# EAGLE design avr_pcb (EAGLE 9.1.0)
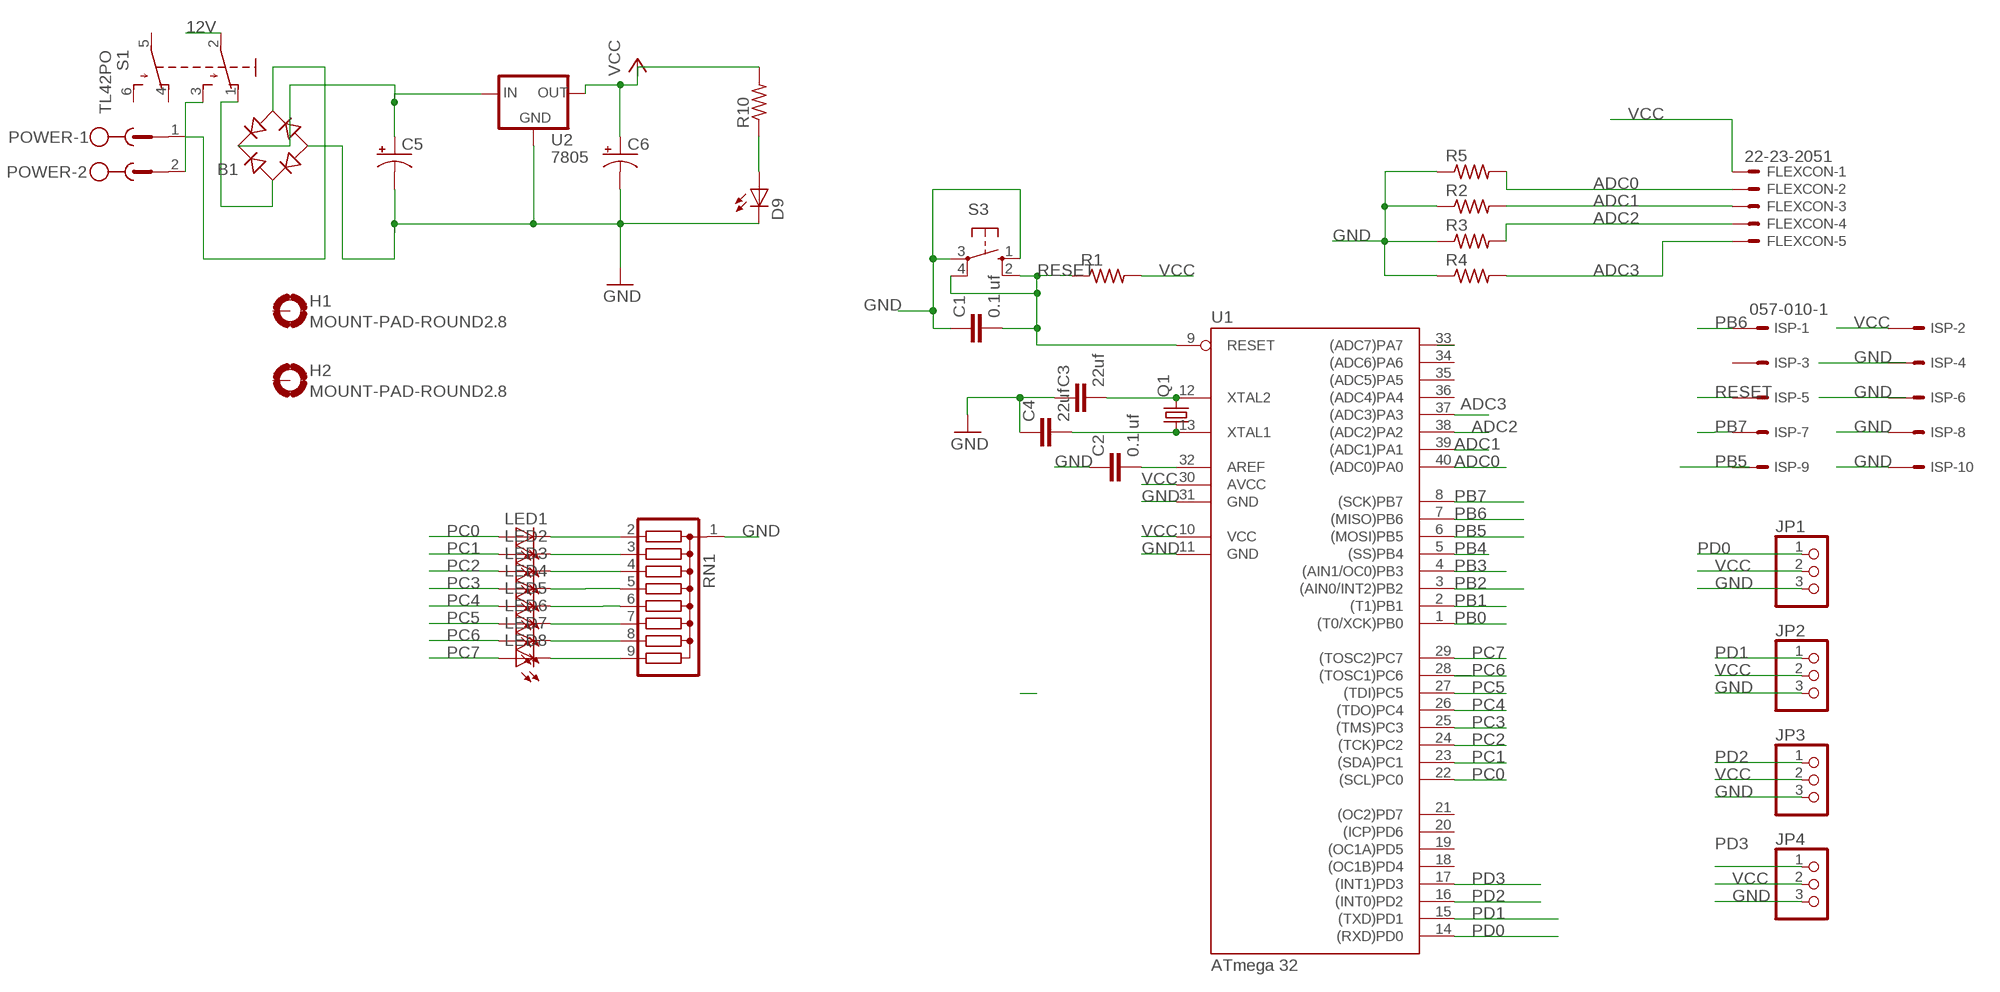
[diagram p0: schematic, sheet 1]

## Parts
B1  RB1A  [RB1A]
C1  0.1 uf  C-EU025-024X044  [C025-024X044]
C2  0.1 uf  C-EU025-024X044  [C025-024X044]
C3  22uf  C-EU025-024X044  [C025-024X044]
C4  22uf  C-EU025-024X044  [C025-024X044]
C5  CPOL-USE5-6  [E5-6]
C6  CPOL-USE5-6  [E5-6]
D9  LED3MM  [LED3MM]
FLEXCON  22-23-2051  [22-23-2051]
H1  MOUNT-PAD-ROUND2.8  [2,8-PAD]
H2  MOUNT-PAD-ROUND2.8  [2,8-PAD]
ISP  057-010-1  [057-010-1]
JP1  PINHD-1X3  [1X03]
JP2  PINHD-1X3  [1X03]
JP3  PINHD-1X3  [1X03]
JP4  PINHD-1X3  [1X03]
LED1  LED3MM  [LED3MM]
LED2  LED3MM  [LED3MM]
LED3  LED3MM  [LED3MM]
LED4  LED3MM  [LED3MM]
LED5  LED3MM  [LED3MM]
LED6  LED3MM  [LED3MM]
LED7  LED3MM  [LED3MM]
LED8  LED3MM  [LED3MM]
POWER  MSTBV2  [MSTBV2]
Q1  CRYSTALHC18U-V  [HC18U-V]
R1  R-US_0204/7  [0204/7]
R2  R-US_0204/7  [0204/7]
R3  R-US_0204/7  [0204/7]
R4  R-US_0204/7  [0204/7]
R5  R-US_0204/7  [0204/7]
R10  R-US_0204/7  [0204/7]
RN1  G08R  [SIL9]
S1  TL42PO  [TL4XPO]
S3  10-XX  [B3F-10XX]
U1  ATmega 32  MEGA32-P  [DIL40]
U2  7805  78XXL  [78XXL]

## Nets
12V: S1.2(P)
ADC0: FLEXCON.2 R5.2 U1.40((ADC0)PA0)
ADC1: FLEXCON.3 R2.2 U1.39((ADC1)PA1)
ADC2: FLEXCON.4 R3.2 U1.38((ADC2)PA2)
ADC3: FLEXCON.5 R4.2 U1.37((ADC3)PA3)
GND: B1.- C1.1 C2.1 C3.1 C4.1 C5.- C6.- D9.K(C) ISP.4 ISP.6 ISP.8 ISP.10 JP1.3 JP2.3 JP3.3 JP4.3 R2.1 R3.1 R4.1 R5.1 RN1.1 S3.1(S) S3.3(P) U1.11(GND) U1.31(GND) U2.GND
N$1: B1.AC1 S1.1(O)
N$2: D9.A R10.1
N$3: C3.2 Q1.2 U1.12(XTAL2)
N$4: C4.2 Q1.1 U1.13(XTAL1)
N$6: C2.2 U1.32(AREF)
N$8: B1.AC2 POWER.1
N$9: LED1.K(C) RN1.2
N$10: LED2.K(C) RN1.3
N$11: LED3.K(C) RN1.4
N$12: LED4.K(C) RN1.5
N$13: LED5.K(C) RN1.6
N$14: LED6.K(C) RN1.7
N$15: LED7.K(C) RN1.8
N$16: LED8.K(C) RN1.9
N$17: POWER.2 S1.3(S)
N$23: B1.+ C5.+ U2.IN
PA7: U1.33((ADC7)PA7)
PB0: U1.1((T0/XCK)PB0)
PB1: U1.2((T1)PB1)
PB2: U1.3((AIN0/INT2)PB2)
PB3: U1.4((AIN1/OC0)PB3)
PB4: U1.5((SS)PB4)
PB5: ISP.9 U1.6((MOSI)PB5)
PB6: ISP.1 U1.7((MISO)PB6)
PB7: ISP.7 U1.8((SCK)PB7)
PC0: LED1.A U1.22((SCL)PC0)
PC1: LED2.A U1.23((SDA)PC1)
PC2: LED3.A U1.24((TCK)PC2)
PC3: LED4.A U1.25((TMS)PC3)
PC4: LED5.A U1.26((TDO)PC4)
PC5: LED6.A U1.27((TDI)PC5)
PC6: LED7.A U1.28((TOSC1)PC6)
PC7: LED8.A U1.29((TOSC2)PC7)
PD0: JP1.1 U1.14((RXD)PD0)
PD1: JP2.1 U1.15((TXD)PD1)
PD2: JP3.1 U1.16((INT0)PD2)
PD3: JP4.1 U1.17((INT1)PD3)
RESET: C1.2 ISP.5 R1.1 S3.2(S1) S3.4(P1) U1.9(RESET)
VCC: C6.+ FLEXCON.1 ISP.2 JP1.2 JP2.2 JP3.2 JP4.2 R1.2 R10.2 U1.10(VCC) U1.30(AVCC) U2.OUT
Unconnected: H1.B2,8(MOUNT) H2.B2,8(MOUNT) ISP.3 S1.4(O1) S1.5(P1) S1.6(S1) U1.18((OC1B)PD4) U1.19((OC1A)PD5) U1.20((ICP)PD6) U1.21((OC2)PD7) U1.34((ADC6)PA6) U1.35((ADC5)PA5) U1.36((ADC4)PA4)

## Library data of the parts
B1 = rectifier:RB1A: RECTIFIER 1 A
C1-C4 = rcl:C-EU: CAPACITOR, European symbol
C5 C6 = rcl:CPOL-US: POLARIZED CAPACITOR, American symbol; SPICEPREFIX: C
D9 LED1-LED8 = led:LED: LED OSRAM: - CHIPLED LG R971, LG N971, LY N971, LG Q971, LY Q971, LO R971, LY R971 LH N974, LH R974 LS Q976, LO Q976, LY Q976 LO Q996 - Hyper CHIPLED LW Q18S LB Q993, LB Q99A, LB R99A - SideLED LS A670, LO A670, LY A670, LG A670, LP A670 LB A673, LV A673, LT A673, LW A673 LH A674 LY A675 LS A676, LA A676, LO A676, LY A676, LW A676 LS A679, LY A679, LG A679 - Hyper Micro SIDELED® LS Y876, LA Y876, LO Y876, LY Y876 LT Y87S - SmartLED LW L88C, LW L88S LB L89C, LB L89S, LG L890 LS L89K, LO L89K, LY L89K LS L896, LA L896, LO L896, LY L896 - TOPLED LS T670, LO T670, LY T670, LG T670, LP T670 LSG T670, LSP T670, LSY T670, LOP T670, LYG T670 LG T671, LOG T671, LSG T671 LB T673, LV T673, LT T673, LW T673 LH T674 LS T676, LA T676, LO T676, LY T676, LB T676, LH T676, LSB T676, LW T676 LB T67C, LV T67C, LT T67C, LS T67K, LO T67K, LY T67K, LW E67C LS E67B, LA E67B, LO E67B, LY E67B, LB E67C, LV E67C, LT E67C LW T67C LS T679, LY T679, LG T679 LS T770, LO T770, LY T770, LG T770, LP T770 LB T773, LV T773, LT T773, LW T773 LH T774 LS E675, LA E675, LY E675, LS T675 LS T776, LA T776, LO T776, LY T776, LB T776 LHGB T686 LT T68C, LB T68C - Hyper Mini TOPLED® LB M676 - Mini TOPLED Santana® LG M470 LS M47K, LO M47K, LY M47K Source: http://www.osram.convergy.de LUXEON: - LUMILED® LXK2-PW12-R00, LXK2-PW12-S00, LXK2-PW14-U00, LXK2-PW14-V00 LXK2-PM12-R00, LXK2-PM12-S00, LXK2-PM14-U00 LXK2-PE12-Q00, LXK2-PE12-R00, LXK2-PE12-S00, LXK2-PE14-T00, LXK2-PE14-U00 LXK2-PB12-K00, LXK2-PB12-L00, LXK2-PB12-M00, LXK2-PB14-N00, LXK2-PB14-P00, LXK2-PB14-Q00 LXK2-PR12-L00, LXK2-PR12-M00, LXK2-PR14-Q00, LXK2-PR14-R00 LXK2-PD12-Q00, LXK2-PD12-R00, LXK2-PD12-S00 LXK2-PH12-R00, LXK2-PH12-S00 LXK2-PL12-P00, LXK2-PL12-Q00, LXK2-PL12-R00 Source: www.luxeon.com KINGBRIGHT: KA-3528ASYC Source: www.kingbright.com
FLEXCON = con-molex:22-23-2051: .100" (2.54mm) Center Header - 5 Pin; MF: MOLEX; MPN: 22-23-2051; OC_FARNELL: 1462952; OC_NEWARK: 38C9178
H1 H2 = holes:MOUNT-PAD-ROUND: MOUNTING PAD, round
ISP = con-panduit:057-010-: CONNECTOR 10-pin series 057 contact pc board low profile headers; OC_FARNELL: unknown; OC_NEWARK: unknown
JP1 = pinhead:PINHD-1X3: PIN HEADER; SPICEPREFIX: J
JP2-JP4 = pinhead:PINHD-1X3: PIN HEADER
POWER = con-phoenix-500:MSTBV2: PHOENIX; OC_FARNELL: unknown; OC_NEWARK: unknown
Q1 = crystal:CRYSTAL: CRYSTAL; OC_FARNELL: unknown; OC_NEWARK: unknown
R1-R5 R10 = resistor:R-US_: RESISTOR, American symbol
RN1 = resistor-sil:G08R: SIL RESISTOR; OC_FARNELL: unknown; OC_NEWARK: unknown
S1 = switch:TL42PO: TINY SWITCH ON - MOM Source: http://www2.produktinfo.conrad.com/datenblaetter/700000-724999/705152-da-01-de-Subminiaturschalter_TL_36YO.pdf
S3 = switch-omron:10-XX: OMRON SWITCH; MPN: B3F-1000; OC_FARNELL: 176432; OC_NEWARK: 36M3542
U1 = atmel:MEGA32-P: MICROCONTROLLER 32 Kbytes FLASH 2 Kbytes SRAM 1 Kbytes EEPROM USART 8-channel 10 bit ADC Source: www.atmel.com .. doc2503.pdf; MPN: ATMEGA32-16PU; OC_FARNELL: 1661729; OC_NEWARK: 51P1794
U2 = v-reg:78XXL: VOLTAGE REGULATOR

## Board
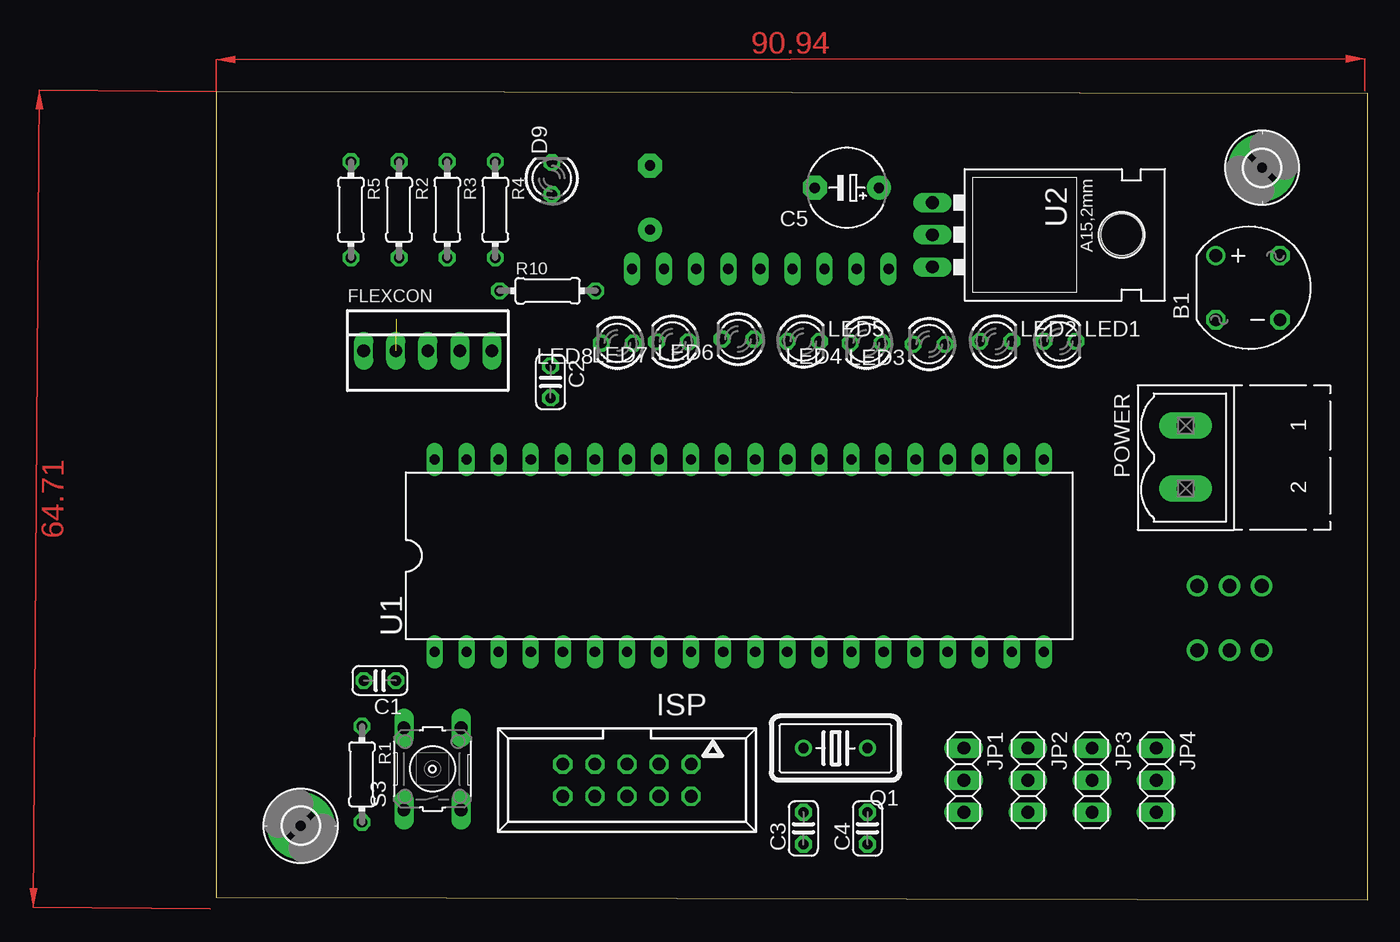
[diagram p1: board, top side]
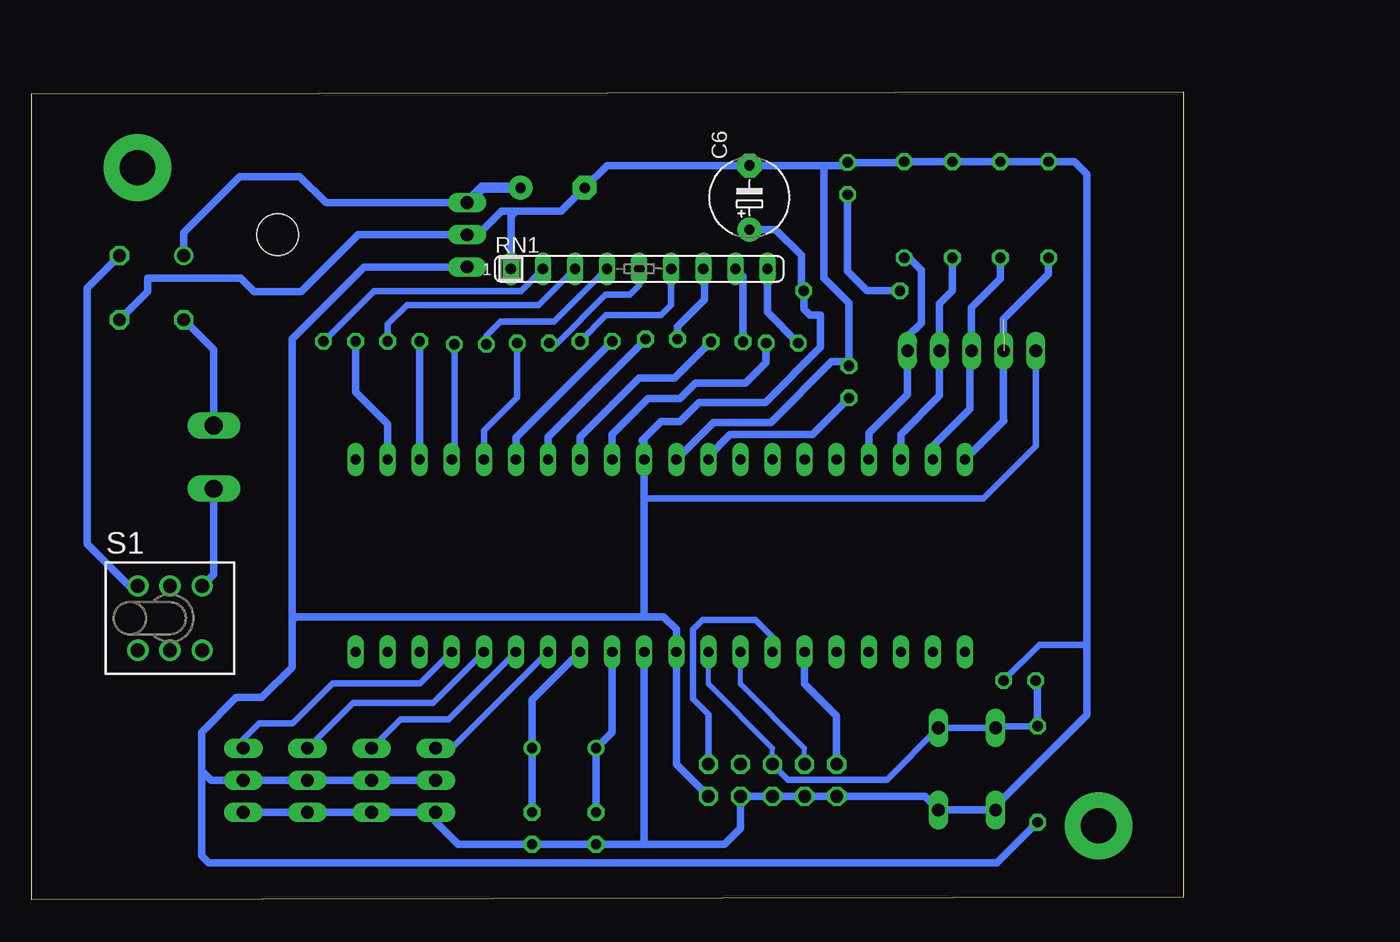
[diagram p2: board, bottom side, seen from below]

Size 91.2 x 64.01 mm. Coordinates in mm from the lower left corner, seen from the top.
Outline: 0.01,0.17 91.2,0 91.19,63.84 0,64.01 0.01,0.17
Copper layers (1*16): Top 0.035mm / dielectric 1.5mm / Bottom 0.035mm
Design rules "default": minimum track width 6mil, minimum drill 0.35mm, track to track 6mil, track to pad 6mil, pad to pad 6mil, via to via 6mil, smd to smd 6mil, copper to edge 40mil, drill to drill 6mil, minimum pad ring 10mil, minimum via ring 8mil, stop-mask expansion 4mil, vias tented up to drill 0mil, thermal gap 10mil

### Footprints (pad centres in the part's own frame; a part is rotated, then mirrored left to right if it is on the bottom)
RB1A = drill 1.016: + -2.54,2.54 | drill 1.016 octagon: - 2.54,-2.54; AC1 2.54,2.54; AC2 -2.54,-2.54
C025-024X044 = drill 0.813 octagon: 1 -1.27,0; 2 1.27,0
E5-6 = drill 0.813 pad 1.905: + -2.54,0 | drill 0.813 pad 1.905 octagon: - 2.54,0
LED3MM = drill 0.813 octagon: A -1.27,0; K 1.27,0
22-23-2051 = drill 1 long: 1 -5.08,0; 2 -2.54,0; 3 0,0; 4 2.54,0; 5 5.08,0
2,8-PAD = drill 2.8 pad 5.334: B2,8 0,0
057-010-1 = drill 1 octagon: 1 -5.08,-1.27; 2 -5.08,1.27; 3 -2.54,-1.27; 4 -2.54,1.27; 5 0,-1.27; 6 0,1.27; 7 2.54,-1.27; 8 2.54,1.27; 9 5.08,-1.27; 10 5.08,1.27
1X03 = drill 1.016 long: 1 -2.54,0; 2 0,0; 3 2.54,0
MSTBV2 = drill 1.397 long: 1 -2.5,0; 2 2.5,0
HC18U-V = drill 0.813: 1 -2.54,0; 2 2.54,0
0204/7 = drill 0.813 octagon: 1 -3.81,0; 2 3.81,0
SIL9 = drill 0.813 long: 1 -10.16,0; 2 -7.62,0; 3 -5.08,0; 4 -2.54,0; 5 0,0; 6 2.54,0; 7 5.08,0; 8 7.62,0; 9 10.16,0
TL4XPO = drill 1.1 pad 1.676: 1 -2.54,2.54; 2 0,2.54; 3 2.54,2.54; 4 -2.54,-2.54; 5 0,-2.54; 6 2.54,-2.54
B3F-10XX = drill 1.016 long: 1 -3.251,2.261; 2 3.251,2.261; 3 -3.251,-2.261; 4 3.251,-2.261
DIL40 = drill 0.813 long: 1 -24.13,-7.62; 2 -21.59,-7.62; 3 -19.05,-7.62; 4 -16.51,-7.62; 5 -13.97,-7.62; 6 -11.43,-7.62; 7 -8.89,-7.62; 8 -6.35,-7.62; 9 -3.81,-7.62; 10 -1.27,-7.62; 11 1.27,-7.62; 12 3.81,-7.62; 13 6.35,-7.62; 14 8.89,-7.62; 15 11.43,-7.62; 16 13.97,-7.62; 17 16.51,-7.62; 18 19.05,-7.62; 19 21.59,-7.62; 20 24.13,-7.62; 21 24.13,7.62; 22 21.59,7.62; 23 19.05,7.62; 24 16.51,7.62; 25 13.97,7.62; 26 11.43,7.62; 27 8.89,7.62; 28 6.35,7.62; 29 3.81,7.62; 30 1.27,7.62; 31 -1.27,7.62; 32 -3.81,7.62; 33 -6.35,7.62; 34 -8.89,7.62; 35 -11.43,7.62; 36 -13.97,7.62; 37 -16.51,7.62; 38 -19.05,7.62; 39 -21.59,7.62; 40 -24.13,7.62
78XXL = drill 1.016 long: GND 0,-3.81; IN -2.54,-3.81; OUT 2.54,-3.81 | hole 3.302: 0,11.176

### Placement (x,y rotation side)
B1  81.7,48.47 0 top
C1  12.96,17.35 180 top
C2  26.47,41.01 270 top
C3  46.49,5.65 90 top
C4  51.57,5.65 90 top
C5  49.94,56.37 180 top
C6  34.35,55.6 90 bottom
D9  26.58,57.12 90 top
FLEXCON  16.75,43.48 0 top
H1  82.82,57.97 0 top
H2  6.69,5.85 90 top
ISP  32.52,9.46 180 top
JP1  59.19,9.46 270 top
JP2  64.27,9.46 270 top
JP3  69.35,9.46 270 top
JP4  74.43,9.46 270 top
LED1  66.82,44.22 0 top
LED2  61.74,44.22 0 top
LED3  56.45,43.99 180 top
LED4  51.47,44.09 180 top
LED5  46.5,44.22 0 top
LED6  41.31,44.39 180 top
LED7  36.13,44.19 180 top
LED8  31.76,44.09 180 top
POWER  76.78,35.05 270 top
Q1  49.03,12 180 top
R1  11.54,9.93 270 top
R2  14.48,54.64 270 top
R3  18.29,54.64 270 top
R4  22.1,54.64 270 top
R5  10.67,54.64 270 top
R10  26.24,48.22 0 top
RN1  43.09,49.97 0 bottom
S1  80.24,22.29 0 bottom
S3  17.12,10.35 90 top
U1  41.41,27.24 0 top
U2  60.53,52.65 270 top

### Tracks (layer width: path | path; a pad name or v marks a point on that pad's centre or on a via)
ADC0  (1 unrouted)
  Bottom 0.61: U1.40 14.21,37.93 14.24,37.95 14.24,45.98 10.67,49.55 R5.2
ADC1
  Bottom 0.406: 19.82,34.6 U1.39
  Bottom 0.61: R2.2 14.48,49.2 16.78,46.9 16.78,43.5 FLEXCON.3 16.88,43.35 16.88,38.87 19.82,35.92 U1.39
ADC2
  Bottom 0.61: U1.38 22.36,36.84 19.29,39.91 FLEXCON.4 19.29,47.23 18.29,48.23 R3.2
ADC3
  Bottom 0.61: R4.2 21.73,50.83 20.74,49.84 20.74,45.68 21.83,44.58 FLEXCON.5 21.86,43.46 21.86,39.99 24.9,36.94 U1.37
GND
  Bottom 0.406: JP4.3 69.61,6.92 JP3.3 JP2.3 | C4.1 C3.1 46.24,4.38 42.68,4.38 | ISP.4 ISP.6 ISP.8 ISP.10 26.94,8.19 26.17,8.19
  Bottom 0.508: 7.63,57.46 7.63,20.18 | 7.63,20.18 7.63,14.62 7.85,14.4 | C1.1 11.4,20.18 7.63,20.18
  Bottom 0.61: 69.61,6.92 JP2.3 JP1.3 59.19,6.15 57.42,4.38 C4.1 46.24,4.38 | JP3.3 JP4.3 | C3.1 42.68,4.38 | 42.68,4.38 36.33,4.38 35.06,5.65 ISP.4 26.94,8.19 | ISP.10 26.17,8.19 20.47,8.19 S3.3 S3.1 14.86,7.39 7.63,14.62 7.63,57.46 8.62,58.45 R5.1 | U1.11 42.68,4.38 | R5.1 R2.1 R3.1 R4.1 | 22.3,58.26 R4.1 | 55.71,52.65 U2.GND 65.35,52.65 69.85,48.16 73.57,48.16 74.64,49.23 81.99,49.23 81.99,48.17 B1.- | R4.1 22.17,58.39 D9.K 26.82,58.14 28.45,58.14 | 28.45,58.14 C6.- 45.63,58.14 C5.- 49.25,54.52 52.84,54.52 | 28.45,58.14 28.45,49.23 26.47,47.25 C2.1 26.81,42.61 27.85,42.61 32.66,37.8 37.2,37.8 U1.31 | R5.1 10.47,58.25 | 55.82,52.65 53.96,54.52 52.84,54.52 | RN1.1 53.25,54.11 52.84,54.52
  Bottom 0.813: 55.82,52.65 U2.GND
N$1
  Bottom 0.61: S1.1 82.92,24.83 83.19,24.56 85.3,26.67 86.17,27.54 86.8,28.17 86.8,48.44 B1.AC1
N$2
  Bottom 0.61: R10.1 25.04,48.22 26.58,49.77 D9.A
N$3
  Bottom 0.406: 46.49,7.17 C3.2
  Bottom 0.61: U1.12 45.22,13.27 Q1.2 46.49,7.17
N$4
  Bottom 0.61: C4.2 Q1.1 51.57,15.81 U1.13
N$6
  Bottom 0.61: C2.2 29.37,36.84 35.88,36.84 37.6,35.11 U1.32
N$8
  Bottom 0.61: B1.AC2 76.78,43.55 POWER.1
N$9
  Bottom 0.508: RN1.2 52.46,48.22 64.09,48.22 LED1.K
N$10
  Bottom 0.508: RN1.3 51.03,47.1 61.48,47.1 63,45.57 LED2.K
N$11
  Bottom 0.508: RN1.4 49.82,45.78 54.06,45.78 55.18,44.66 LED3.K
N$12
  Bottom 0.508: LED4.K 49.56,44.09 45.73,47.91 43.8,47.91 43.09,48.63 RN1.5
N$13
  Bottom 0.508: LED5.K 45.7,46.29 41.36,46.29 40.55,47.1 RN1.6
N$14
  Bottom 0.61: LED6.K 40.04,45.37 37.91,47.51 37.91,49.87 RN1.7
N$15
  Bottom 0.61: LED7.K 34.86,49.36 RN1.8
N$16
  Bottom 0.61: 32.52,49.57 RN1.9 32.93,46.52 LED8.K
N$17
  Bottom 0.61: POWER.2 76.78,25.76 S1.3
N$23
  Bottom 0.61: B1.+ 79.16,52.82 74.72,57.26 69.96,57.26 67.89,55.19 U2.IN
  Bottom 0.813: U2.IN 55.54,56.37 C5.+
PB5
  Bottom 0.406: 27.44,14.28 27.44,14.54 | 29.98,17.08 29.98,17.33 | 29.98,19.36 U1.6
  Bottom 0.61: ISP.9 27.44,14.28 | 27.44,14.54 29.98,17.08 | 29.98,17.33 29.98,19.36
PB6
  Bottom 0.508: U1.7 32.52,20.82 33.86,22.16 38.07,22.16 38.82,21.41 38.82,15.91 37.6,14.69 ISP.1
PB7
  Bottom 0.406: U1.8 35.06,17.08 29.98,12 ISP.7
PC0
  Bottom 0.61: U1.22 63,37.65 65.54,40.19 LED1.A
PC1
  Bottom 0.61: U1.23 | U1.23 LED2.A
PC2
  Bottom 0.508: LED3.A 57.72,35.06 U1.24
PC3
  Bottom 0.508: U1.25 55.38,37.14 52.74,39.78 LED4.A
PC4
  Bottom 0.61: LED5.A 52.84,36.6 U1.26
PC5
  Bottom 0.61: U1.27 50.3,36.63 42.58,44.36 LED6.A
PC6
  Bottom 0.61: LED7.A 40.28,41.31 43.09,41.31 47.76,36.63 U1.28
PC7
  Bottom 0.61: 45.22,35.92 U1.29 45.22,36.84 42.38,39.68 39.84,39.68 38.62,40.9 34.66,40.9 33.03,42.53 LED8.A
PD0
  Bottom 0.508: U1.14 57.92,12 JP1.1
  Bottom 0.61: U1.14 50.56,19.62
PD1
  Bottom 0.406: U1.15 53.29,19.62
  Bottom 0.508: U1.15 58.18,14.28 61.99,14.28 JP2.1
PD2
  Bottom 0.406: U1.16 55.83,19.62
  Bottom 0.508: U1.16 59.4,15.6 65.75,15.6 JP3.1
PD3
  Bottom 0.508: U1.17 60.41,17.13 67.37,17.13 70.52,13.98 73.16,13.98 74.43,12.71 JP4.1
RESET
  Bottom 0.406: ISP.5 32.52,12 37.6,17.08 U1.9
  Bottom 0.508: R1.1 14.73,13.74 S3.2 S3.4 23.48,9.51 31.31,9.51 ISP.5
  Bottom 0.61: R1.1 11.54,17.21 C1.2
VCC
  Bottom 0.406: JP1.2 JP2.2 64.53,9.46 JP3.2
  Bottom 0.508: FLEXCON.1 11.67,35.93 15.81,31.78 42.68,31.78
  Bottom 0.61: JP1.2 64.53,9.46 | JP2.2 JP3.2 JP4.2 76.97,9.46 77.74,10.22 | ISP.2 40.14,10.73 U1.10 40.14,21.39 41.16,22.41 42.89,22.41 | 42.89,22.41 70.26,22.41 70.56,22.11 | 77.74,10.22 77.74,13.27 74.99,16.01 72.96,16.01 70.56,18.41 70.56,22.11 | C6.+ 32.28,53.06 30.25,51.03 30.25,48.43 R10.2 30.05,46.76 29.58,46.29 28.71,46.29 28.71,43.75 33.09,39.37 38.34,39.37 39.84,37.87 41.34,37.87 42.34,36.87 42.68,36.53 | R1.2 14.75,2.91 77.18,2.91 77.74,3.46 77.74,10.22 | 42.89,22.41 42.68,22.61 42.68,31.78 U1.30 42.68,36.53 | U2.OUT 64.86,50.11 70.56,44.42 70.56,22.11 | 42.68,36.53 42.84,36.37
(copper drawn outside any net)
  shapes: Top area x2